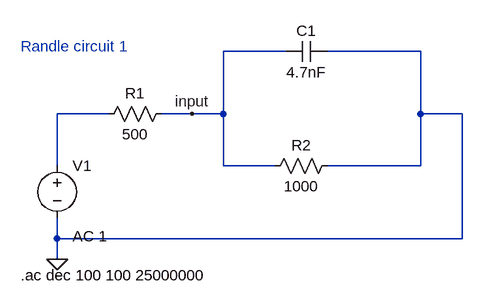
[diagram p0: schematic Randle circuit 1 alt.asc]
Randle circuit 1 alt.asc, the LTspice schematic file:
Version 4
SHEET 1 916 784
WIRE 336 64 240 64
WIRE 544 64 400 64
WIRE 64 160 -16 160
WIRE 192 160 144 160
WIRE 240 160 240 64
WIRE 240 160 192 160
WIRE 544 160 544 64
WIRE 608 160 544 160
WIRE -16 240 -16 160
WIRE 240 240 240 160
WIRE 320 240 240 240
WIRE 544 240 544 160
WIRE 544 240 400 240
WIRE -16 352 -16 320
WIRE 608 352 608 160
WIRE 608 352 -16 352
WIRE -16 384 -16 352
FLAG -16 384 0
FLAG 192 160 input
SYMBOL res 160 144 R90
WINDOW 0 0 56 VBottom 2
WINDOW 3 32 56 VTop 2
SYMATTR InstName R1
SYMATTR Value 500
SYMBOL res 416 224 R90
WINDOW 0 0 56 VBottom 2
WINDOW 3 32 56 VTop 2
SYMATTR InstName R2
SYMATTR Value 1000
SYMBOL cap 400 48 R90
WINDOW 0 0 32 VBottom 2
WINDOW 3 32 32 VTop 2
SYMATTR InstName C1
SYMATTR Value 4.7nF
SYMBOL voltage -16 224 R0
WINDOW 123 24 124 Left 2
WINDOW 39 0 0 Left 0
SYMATTR Value2 AC 1
SYMATTR InstName V1
SYMATTR Value ""
TEXT -72 56 Left 2 ;Randle circuit 1
TEXT -72 408 Left 2 !.ac dec 100 100 25000000

The netlist it stands for:
* Randle circuit 1 alt.asc
R1 input N001 500
R2 0 input 1000
C1 0 input 4.7nF
V1 N001 0 AC 1
* Randle circuit 1
.ac dec 100 100 25000000
.backanno
.end

* Results of the author's LTspice run, read from the files saved beside the schematic
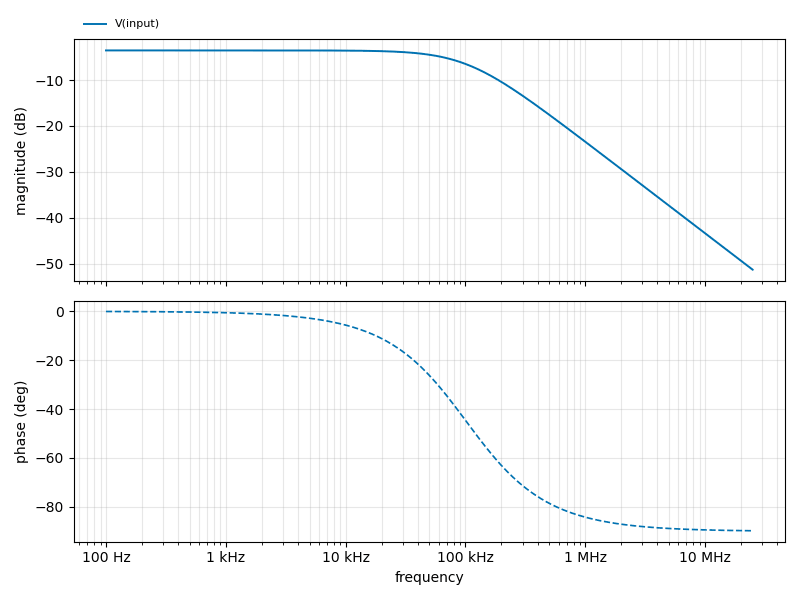
[diagram p1: AC Analysis of Randle circuit 1 alt.asc, plotted from the saved traces]
* AC Analysis, 1 run:
*   V(input): -3.52 dB at 100 Hz, -51.34 dB at 25 MHz, peak -3.52 dB at 100 Hz, 3 dB below the peak at 101.6 kHz